# Altium project PCB_Project.PrjPcb
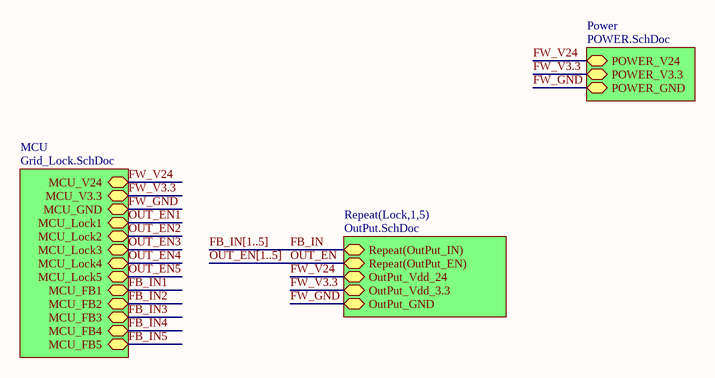
[diagram p0: framework.SchDoc]
4 sheets, 126 parts. Net scope: hierarchical (ports join the sheet entries above them; power ports are global).
Board file: GRID.PcbDoc
Sheets:
  framework.SchDoc
    MCU = Grid_Lock.SchDoc
    Lock1 = OutPut.SchDoc
    Lock2 = OutPut.SchDoc
    Lock3 = OutPut.SchDoc
    Lock4 = OutPut.SchDoc
    Lock5 = OutPut.SchDoc
    Power = POWER.SchDoc

## Sheet framework.SchDoc
size A4

### Sub-sheets
MCU = Grid_Lock.SchDoc: MCU_Lock4, MCU_Lock5, MCU_Lock2, MCU_FB4, MCU_FB2, MCU_FB5, MCU_FB1, MCU_Lock1, MCU_Lock3, MCU_FB3, MCU_V3.3, MCU_GND, MCU_V24
Power = POWER.SchDoc: POWER_GND, POWER_V24, POWER_V3.3
Repeat(Lock,1,5) = OutPut.SchDoc: Repeat(OutPut_IN), Repeat(OutPut_EN), OutPut_Vdd_24, OutPut_GND, OutPut_Vdd_3.3

### Nets
FW_GND: sheet MCU/MCU_GND, sheet Repeat(Lock,1,5)/OutPut_GND, sheet Power/POWER_GND
FW_V3.3: sheet MCU/MCU_V3.3, sheet Repeat(Lock,1,5)/OutPut_Vdd_3.3, sheet Power/POWER_V3.3
FW_V24: sheet MCU/MCU_V24, sheet Repeat(Lock,1,5)/OutPut_Vdd_24, sheet Power/POWER_V24
FB_IN: sheet Repeat(Lock,1,5)/Repeat(OutPut_IN)
OUT_EN: sheet Repeat(Lock,1,5)/Repeat(OutPut_EN)

### Buses and harness runs
bus FB_IN[1..5]
bus OUT_EN[1..5]

## Sheet Grid_Lock.SchDoc
size A4
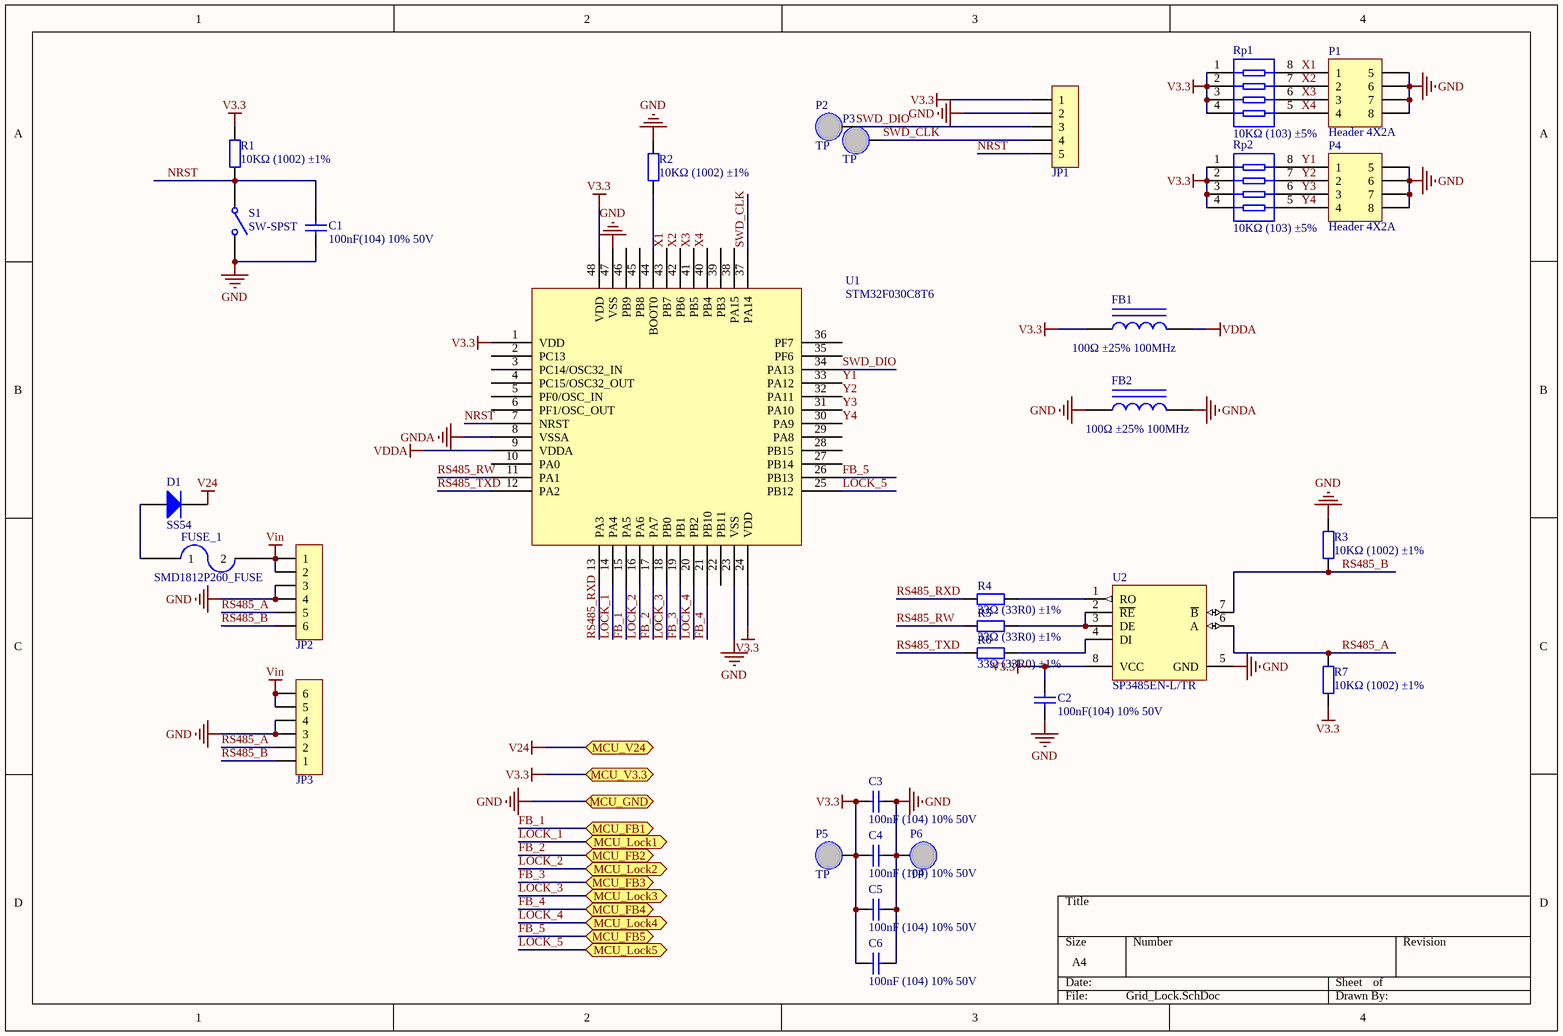
[diagram p1: Grid_Lock.SchDoc]

### Parts
C1  100nF(104) 10% 50V  [0805_C]
C2  100nF(104) 10% 50V  [0805_C]
C3  100nF (104) 10% 50V  [0603_C]
C4  100nF (104) 10% 50V  [0603_C]
C5  100nF (104) 10% 50V  [0603_C]
C6  100nF (104) 10% 50V  [0603_C]
D1  SS54  [SMA(DO-214AC)_S1]
FB1  100Ω ±25% 100MHz  [0805_L]
FB2  100Ω ±25% 100MHz  [0805_L]
FUSE_1  SMD1812P260_FUSE  [SMD1812P260]
JP1  HDR-1X5  [XH2.54-WS-5P]  (value not drawn)
JP2  HDR-1X6  [XH2.54-WS-6P]  (value not drawn)
JP3  HDR-1X6  [XH2.54-WS-6P]  (value not drawn)
P1  Header 4X2A  [HDR2X4_CEN]
P2  TP
P3  TP
P4  Header 4X2A  [HDR2X4_CEN]
P5  TP
P6  TP
R1  10KΩ (1002) ±1%  [0805_R]
R2  10KΩ (1002) ±1%  [0805_R]
R3  10KΩ (1002) ±1%  [0805_R]
R4  33Ω (33R0) ±1%  [0603_R]
R5  33Ω (33R0) ±1%  [0603_R]
R6  33Ω (33R0) ±1%  [0603_R]
R7  10KΩ (1002) ±1%  [0805_R]
Rp1  10KΩ (103) ±5%  [0603_Rx4]
Rp2  10KΩ (103) ±5%  [0603_Rx4]
S1  SW-SPST  [key]
U1  STM32F030C8T6  [LQFP-48_7x7x05P]
U2  SP3485EN-L/TR  [SOIC-8_150mil]

### Ports
MCU_FB1, MCU_FB2, MCU_FB3, MCU_FB4, MCU_FB5, MCU_GND, MCU_Lock1, MCU_Lock2, MCU_Lock3, MCU_Lock4, MCU_Lock5, MCU_V3.3, MCU_V24

### Nets
GND: C1.1 C2.1 C3.2 C4.2 C5.2 C6.2 FB2.1 JP1.2 JP2.3 JP2.4 JP3.3 JP3.4 P1.5 P1.6 P1.7 P1.8 P4.5 P4.6 P4.7 P4.8 P6.1 R2.2 R3.2 S1.2(NO) U1.23(VSS) U1.47(VSS) U2.5(GND) ; port MCU_GND  [project net FW_GND]
GNDA: FB2.2 U1.8(VSSA)
V3.3: C2.2 C3.1 C4.1 C5.1 C6.1 FB1.1 JP1.1 P5.1 R1.2 R7.1 Rp1.1 Rp1.2 Rp1.3 Rp1.4 Rp2.1 Rp2.2 Rp2.3 Rp2.4 U1.1(VDD) U1.24(VDD) U1.48(VDD) U2.8(VCC) ; port MCU_V3.3  [project net FW_V3.3]
V24: D1.2(K) ; port MCU_V24  [project net FW_V24]
VDDA: FB1.2 U1.9(VDDA)
Vin: FUSE_1.2 JP2.1 JP2.2 JP3.5 JP3.6
FB_1: U1.15(PA5) ; port MCU_FB1
FB_2: U1.17(PA7) ; port MCU_FB2
FB_3: U1.19(PB1) ; port MCU_FB3
FB_4: U1.21(PB10) ; port MCU_FB4
FB_5: U1.26(PB13) ; port MCU_FB5
LOCK_1: U1.14(PA4) ; port MCU_Lock1  [project net EN]
LOCK_2: U1.16(PA6) ; port MCU_Lock2  [project net EN]
LOCK_3: U1.18(PB0) ; port MCU_Lock3  [project net EN]
LOCK_4: U1.20(PB2) ; port MCU_Lock4  [project net EN]
LOCK_5: U1.25(PB12) ; port MCU_Lock5  [project net EN]
NRST: C1.2 JP1.5 R1.1 S1.1(COMMON) U1.7(NRST)
RS485_A: JP2.5 JP3.2 R7.2 U2.6(A)
RS485_B: JP2.6 JP3.1 R3.1 U2.7(~{B})
RS485_RW: R5.1 U1.11(PA1)
RS485_RXD: R4.1 U1.13(PA3)
RS485_TXD: R6.1 U1.12(PA2)
SWD_CLK: JP1.4 P3.1 U1.37(PA14)
SWD_DIO: JP1.3 P2.1 U1.34(PA13)
X1: P1.1 Rp1.8 U1.43(PB7)
X2: P1.2 Rp1.7 U1.42(PB6)
X3: P1.3 Rp1.6 U1.41(PB5)
X4: P1.4 Rp1.5 U1.40(PB4)
Y1: P4.1 Rp2.8 U1.33(PA12)
Y2: P4.2 Rp2.7 U1.32(PA11)
Y3: P4.3 Rp2.6 U1.31(PA10)
Y4: P4.4 Rp2.5 U1.30(PA9)
NetD1_1: D1.1(A) FUSE_1.1
NetR2_1: R2.1 U1.44(BOOT0)
NetR4_2: R4.2 U2.1(RO)
NetR5_2: R5.2 U2.2(~{RE}) U2.3(DE)
NetR6_2: R6.2 U2.4(DI)

Not connected (* = marked no-connect by the designer): U1 2(PC13) 3(PC14/OSC32_IN) 4(PC15/OSC32_OUT) 5(PF0/OSC_IN) 6(PF1/OSC_OUT) 10(PA0) 22(PB11) 27(PB14) 28(PB15) 29(PA8) 35(PF6) 36(PF7) 38(PA15) 39(PB3) 45(PB8) 46(PB9)

### Library data of the parts
C1 C2 = 0805 100nF(104) 10% 50V: 贴片电容; ComponentLink1Description: 供应商链接; ComponentLink1URL: http://www.szlcsc.com/product/details_50686.html; Package: 0805; Supplier: LC; SuppliersPartNumber: C49678
C3-C6 = 0603 100nF (104) 10% 50V: 贴片电容; ComponentLink1Description: 供应商链接; ComponentLink1URL: http://www.szlcsc.com/product/details_15331.html; Package: 0603; Supplier: LC; SuppliersPartNumber: C14663
D1 = SMA(DO-214AC) SS54: 二极管; ComponentLink1Description: 供应商链接; ComponentLink1URL: http://www.szlcsc.com/product/details_23178.html; Package: SMA(DO-214AC); Supplier: LC; SuppliersPartNumber: C22452
FB1 FB2 = 0805 100Ω 25% 100MHz: 贴片磁珠; ComponentLink1Description: 供应商链接; ComponentLink1URL: http://www.szlcsc.com/product/details_1367.html; Package: 0805; Supplier: LC; SuppliersPartNumber: C1015
JP1 = Header 5: 5P接插件; 版权归属: 源创客; BOM名称: 5P接插件; 学习资源: www.ooocke.com
JP2 JP3 = Header 6: 6P接插件; 版权归属: 源创客; BOM名称: 6P接插件; 学习资源: www.ooocke.com
P1 P4 = Header 4X2A: Header, 4-Pin, Dual row; LatestRevisionDate: 17-Jul-2002; LatestRevisionNote: Re-released for DXP Platform.; Publisher: Altium Limited
R1-R3 R7 = 0805 10KΩ (1002) 1%: 贴片电阻; ComponentLink1Description: 供应商链接; ComponentLink1URL: http://www.szlcsc.com/product/details_18102.html; Package: 0805; Supplier: LC; SuppliersPartNumber: C17414
R4-R6 = 0603 33Ω (33R0) 1%: 贴片电阻; ComponentLink1Description: 供应商链接; ComponentLink1URL: http://www.szlcsc.com/product/details_23867.html; Package: 0603; Supplier: LC; SuppliersPartNumber: C23140
Rp1 Rp2 = 0603*4  10KΩ (103) 5%: 贴片排阻; ComponentLink1Description: 供应商链接; ComponentLink1URL: http://www.szlcsc.com/product/details_30472.html; Package: 0603*4; Supplier: LC; SuppliersPartNumber: C29718
S1 = SW-SPST: Single-Pole, Single-Throw Switch; Published: 24-Mar-1999; LatestRevisionDate: 17-Jul-2002; LatestRevisionNote: Re-released for DXP Platform.; PackageReference: SPST-2; Publisher: Altium Limited; PackageDescription: Switch; 2 Leads
U1 = STM32F030C8T6: ARM; ComponentLink1Description: 供应商链接; ComponentLink1URL: http://www.szlcsc.com/product/details_24662.html; Package: LQFP-48_7x7x05P; Supplier: LC; SuppliersPartNumber: C23922
U2 = SP3485EN-L/TR_[C8963]: RS-485/RS-422; ComponentLink1Description: 供应商链接; ComponentLink1URL: http://www.szlcsc.com/product/details_9482.html; Package: SOIC-8; Supplier: LC; SuppliersPartNumber: C8963

## Sheet OutPut.SchDoc
size A4
Used 5 times, as channels Lock1, Lock2, Lock3, Lock4, Lock5. Parts and nets are listed once, with the designators drawn on the sheet.
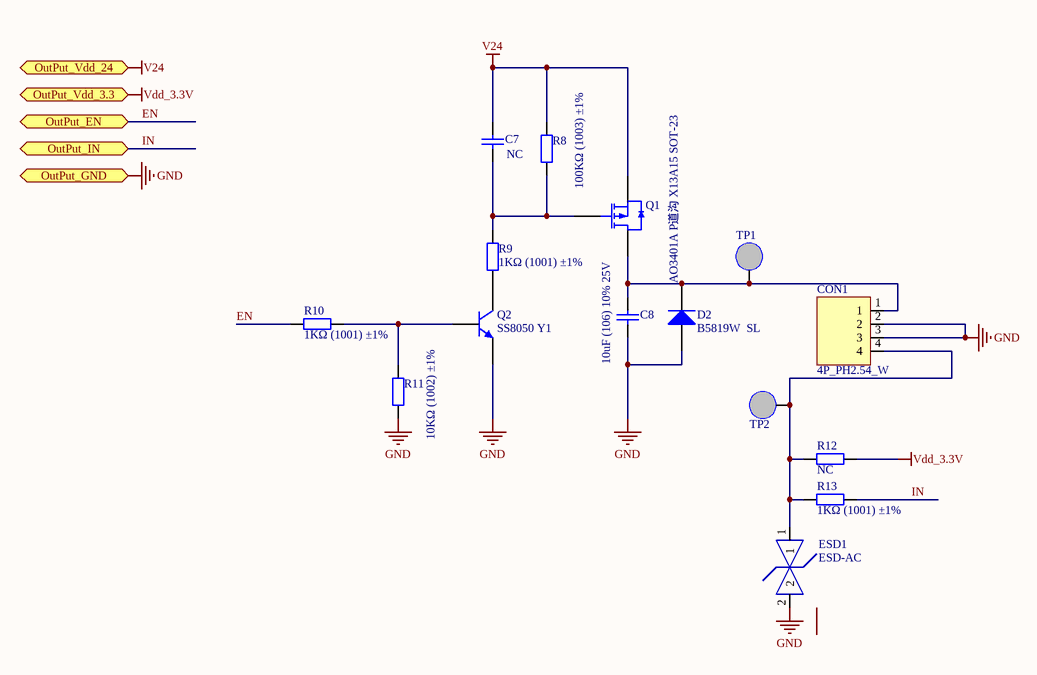
[diagram p2: OutPut.SchDoc]

### Parts
C7  NC  [0805_C]
C8  10uF (106) 10% 25V  [0805_C]
CON1  4P_PH2.54_W  [PH2.0-WS-4P]
D2  B5819W  SL  [SOD-123]
ESD1  ESD-AC  [SOD-523]
Q1  AO3401A P道沟 X13A15 SOT-23  [SOT-23-3L]
Q2  SS8050 Y1  [SOT-23(SOT-23-3)]
R8  100KΩ (1003) ±1%  [0805_R]
R9  1KΩ (1001) ±1%  [0805_R]
R10  1KΩ (1001) ±1%  [0805_R]
R11  10KΩ (1002) ±1%  [0805_R]
R12  NC  [0805_R]
R13  1KΩ (1001) ±1%  [0805_R]
TP1  TP  [TP]  (value not drawn)
TP2  TP  [TP]  (value not drawn)

### Ports
OutPut_EN, OutPut_GND, OutPut_IN, OutPut_Vdd_3.3, OutPut_Vdd_24

### Nets
GND: C8.1 CON1.2 CON1.3 D2.1(A) ESD1.2 Q2.2(E) R11.1 ; port OutPut_GND
V24: C7.2 Q1.2(S) R8.2 ; port OutPut_Vdd_24
Vdd_3.3V: R12.2 ; port OutPut_Vdd_3.3
EN: R10.1 ; port OutPut_EN
IN: R13.2 ; port OutPut_IN
NetC7_1: C7.1 Q1.1(G) R8.1 R9.1
NetC8_2: C8.2 CON1.1 D2.2(K) Q1.3(D) TP1.1
NetCON1_4: CON1.4 ESD1.1 R12.1 R13.1 TP2.1
NetQ2_1: Q2.1(B) R10.2 R11.2
NetQ2_3: Q2.3(C) R9.2

Not connected (* = marked no-connect by the designer): CON1 A B

### Channels
Lock1: designators end in _Lock1; ports OutPut_EN=EN OutPut_GND=FW_GND OutPut_IN=FB_1 OutPut_Vdd_3.3=FW_V3.3 OutPut_Vdd_24=FW_V24
Lock2: designators end in _Lock2; ports OutPut_EN=EN OutPut_GND=FW_GND OutPut_IN=FB_2 OutPut_Vdd_3.3=FW_V3.3 OutPut_Vdd_24=FW_V24
Lock3: designators end in _Lock3; ports OutPut_EN=EN OutPut_GND=FW_GND OutPut_IN=FB_3 OutPut_Vdd_3.3=FW_V3.3 OutPut_Vdd_24=FW_V24
Lock4: designators end in _Lock4; ports OutPut_EN=EN OutPut_GND=FW_GND OutPut_IN=FB_4 OutPut_Vdd_3.3=FW_V3.3 OutPut_Vdd_24=FW_V24
Lock5: designators end in _Lock5; ports OutPut_EN=EN OutPut_GND=FW_GND OutPut_IN=FB_5 OutPut_Vdd_3.3=FW_V3.3 OutPut_Vdd_24=FW_V24

### Library data of the parts
C7 = 0805 22uF (226) 20% 25V: 贴片电容; ComponentLink1Description: 供应商链接; ComponentLink1URL: http://www.szlcsc.com/product/details_46786.html; Package: 0805; Supplier: LC; SuppliersPartNumber: C45783
C8 = 0805 10uF (106) 10% 25V: 贴片电容; ComponentLink1Description: 供应商链接; ComponentLink1URL: http://www.szlcsc.com/product/details_16532.html; Package: 0805; Supplier: LC; SuppliersPartNumber: C15850
CON1 = 4P_XH2.54_W
D2 = SOD-123 B5819W  SL: 肖特基二极管; ComponentLink1Description: 供应商链接; ComponentLink1URL: http://www.szlcsc.com/product/details_9093.html; Package: SOD-123; Supplier: LC; SuppliersPartNumber: C8598
Q1 = AO3401A P道沟 X13A15 SOT-23: MOS(场效应管); ComponentLink1Description: 供应商链接; ComponentLink1URL: http://www.szlcsc.com/product/details_15801.html; Package: SOT-23; Supplier: LC; SuppliersPartNumber: C15127
Q2 = SOT-23 SS8050 Y1: 三极管; ComponentLink1Description: 供应商链接; ComponentLink1URL: http://www.szlcsc.com/product/details_2507.html; Package: SOT-23; Supplier: LC; SuppliersPartNumber: C2150
R8 = 0805 100KΩ (1003) 1%: 贴片电阻; ComponentLink1Description: 供应商链接; ComponentLink1URL: http://www.szlcsc.com/product/details_18095.html; Package: 0805; Supplier: LC; SuppliersPartNumber: C17407
R9 R10 R12 R13 = 0805 1KΩ (1001) 1%: 贴片电阻; ComponentLink1Description: 供应商链接; ComponentLink1URL: http://www.szlcsc.com/product/details_18201.html; Package: 0805; Supplier: LC; SuppliersPartNumber: C17513
R11 = 0805 10KΩ (1002) 1%: 贴片电阻; ComponentLink1Description: 供应商链接; ComponentLink1URL: http://www.szlcsc.com/product/details_18102.html; Package: 0805; Supplier: LC; SuppliersPartNumber: C17414

## Sheet POWER.SchDoc
size A4
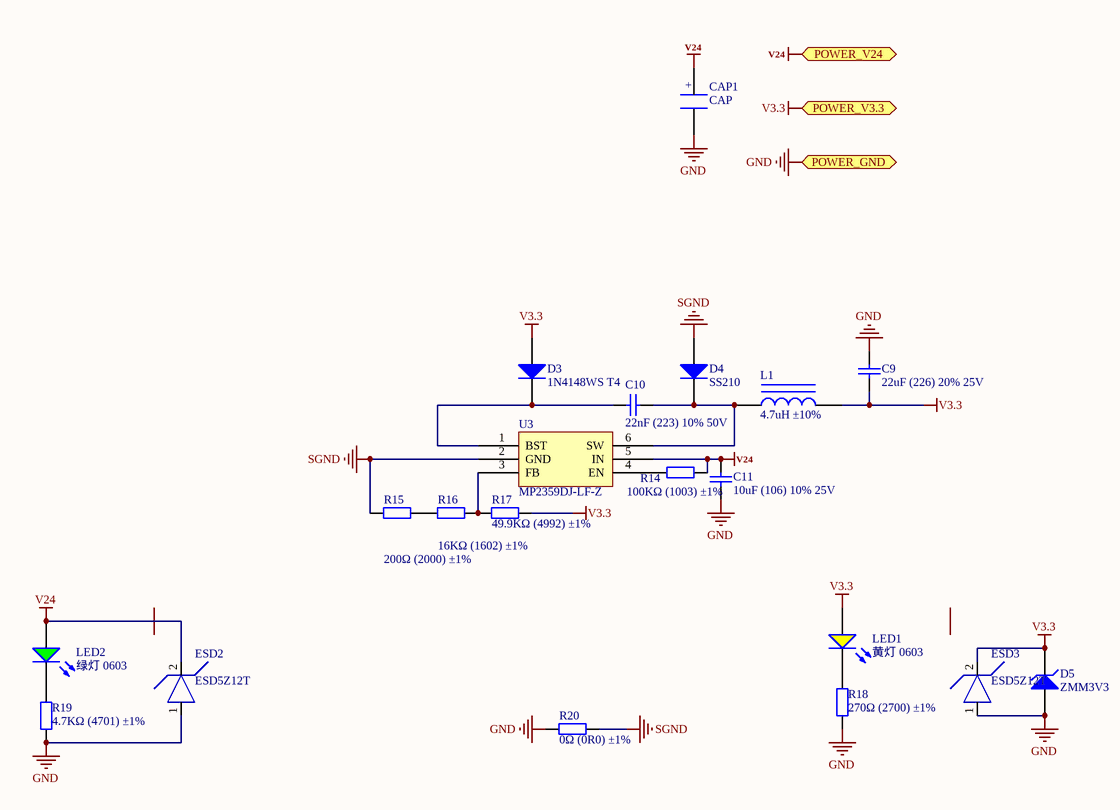
[diagram p3: POWER.SchDoc]

### Parts
C9  22uF (226) 20% 25V  [0805_C]
C10  22nF (223) 10% 50V  [0603_C]
C11  10uF (106) 10% 25V  [0805_C]
CAP1  CAP  [8X12_CAP]
D3  1N4148WS T4  [SOD-323]
D4  SS210  [SMA(DO-214AC)_S1]
D5  ZMM3V3  [LL-34]
ESD2  ESD5Z12T  [SOD-523]
ESD3  ESD5Z12T  [SOD-523]
L1  4.7uH ±10%  [L_4030]
LED1  黄灯 0603  [0603_LED_S1]
LED2  绿灯 0603  [0603_LED_S1]
R14  100KΩ (1003) ±1%  [0603_R]
R15  200Ω (2000) ±1%  [0603_R]
R16  16KΩ (1602) ±1%  [0603_R]
R17  49.9KΩ (4992) ±1%  [0603_R]
R18  270Ω (2700) ±1%  [0805_R]
R19  4.7KΩ (4701) ±1%  [0805_R]
R20  0Ω (0R0) ±1%  [0603_R]
U3  MP2359DJ-LF-Z  [SOT-23-6]

### Ports
POWER_GND, POWER_V3.3, POWER_V24

### Nets
GND: C9.2 C11.1 CAP1.2 D5.1(A) ESD2.1 ESD3.1 R18.1 R19.1 R20.1 ; port POWER_GND  [project net FW_GND]
SGND: D4.1(A) R15.2 R20.2 U3.2(GND)
V3.3: C9.1 D3.1(A) D5.2(K) ESD3.2 L1.2 LED1.A R17.2 ; port POWER_V3.3  [project net FW_V3.3]
V24: C11.2 CAP1.1 ESD2.2 LED2.A R14.2 U3.5(IN) ; port POWER_V24  [project net FW_V24]
NetC10_1: C10.1 D3.2(K) U3.1(BST)
NetC10_2: C10.2 D4.2(K) L1.1 U3.6(SW)
NetLED1_K: LED1.K R18.2
NetLED2_K: LED2.K R19.2
NetR14_1: R14.1 U3.4(EN)
NetR15_1: R15.1 R16.2
NetR16_1: R16.1 R17.1 U3.3(FB)

### Notes on the sheet
- (in symbol CAP) +

### Library data of the parts
C9 = 0805 22uF (226) 20% 25V: 贴片电容; ComponentLink1Description: 供应商链接; ComponentLink1URL: http://www.szlcsc.com/product/details_46786.html; Package: 0805; Supplier: LC; SuppliersPartNumber: C45783
C10 = 0603 22nF (223) 10% 50V: 贴片电容; ComponentLink1Description: 供应商链接; ComponentLink1URL: http://www.szlcsc.com/product/details_21834.html; Package: 0603; Supplier: LC; SuppliersPartNumber: C21122
C11 = 0805 10uF (106) 10% 25V: 贴片电容; ComponentLink1Description: 供应商链接; ComponentLink1URL: http://www.szlcsc.com/product/details_16532.html; Package: 0805; Supplier: LC; SuppliersPartNumber: C15850
D3 = SOD-323 1N4148WS T4: 二极管; ComponentLink1Description: 供应商链接; ComponentLink1URL: http://www.szlcsc.com/product/details_2485.html; Package: SOD-323; Supplier: LC; SuppliersPartNumber: C2128
D4 = SMA(DO-214AC) SS210: 二极管; ComponentLink1Description: 供应商链接; ComponentLink1URL: http://www.szlcsc.com/product/details_15669.html; Package: SMA(DO-214AC); Supplier: LC; SuppliersPartNumber: C14996
D5 = LL-34 ZMM3V3: 稳压二极管; ComponentLink1Description: 供应商链接; ComponentLink1URL: http://www.szlcsc.com/product/details_8535.html; Package: LL-34; Supplier: LC; SuppliersPartNumber: C8056
ESD2 ESD3 = ESD-D
L1 = 0603 4.7uH 10%: 贴片电感; ComponentLink1Description: 供应商链接; ComponentLink1URL: http://www.szlcsc.com/product/details_1386.html; Package: 0603; Supplier: LC; SuppliersPartNumber: C1034
LED1 = 0603 黄灯: 发光二极管; ComponentLink1Description: 供应商链接; ComponentLink1URL: http://www.szlcsc.com/product/details_73147.html; Package: 0603; Supplier: LC; SuppliersPartNumber: C72038
LED2 = 0603 绿灯: 发光二极管; ComponentLink1Description: 供应商链接; ComponentLink1URL: http://www.szlcsc.com/product/details_73152.html; Package: 0603; Supplier: LC; SuppliersPartNumber: C72043
R14 = 0603 100KΩ (1003) 1%: 贴片电阻; ComponentLink1Description: 供应商链接; ComponentLink1URL: http://www.szlcsc.com/product/details_26546.html; Package: 0603; Supplier: LC; SuppliersPartNumber: C25803
R15 = 0603 200Ω (2000) 1%: 贴片电阻; ComponentLink1Description: 供应商链接; ComponentLink1URL: http://www.szlcsc.com/product/details_8708.html; Package: 0603; Supplier: LC; SuppliersPartNumber: C8218
R16 = 0603 16KΩ (1602) 1%: 贴片电阻; ComponentLink1Description: 供应商链接; ComponentLink1URL: http://www.szlcsc.com/product/details_23545.html; Package: 0603; Supplier: LC; SuppliersPartNumber: C22818
R17 = 0603 49.9KΩ (4992) 1%: 贴片电阻; ComponentLink1Description: 供应商链接; ComponentLink1URL: http://www.szlcsc.com/product/details_23911.html; Package: 0603; Supplier: LC; SuppliersPartNumber: C23184
R18 = 0805 270Ω (2700) 1%: 贴片电阻; ComponentLink1Description: 供应商链接; ComponentLink1URL: http://www.szlcsc.com/product/details_18278.html; Package: 0805; Supplier: LC; SuppliersPartNumber: C17590
R19 = 0805 4.7KΩ (4701) 1%: 贴片电阻; ComponentLink1Description: 供应商链接; ComponentLink1URL: http://www.szlcsc.com/product/details_18361.html; Package: 0805; Supplier: LC; SuppliersPartNumber: C17673
R20 = 0603 0Ω (0R0) 1%: 贴片电阻; ComponentLink1Description: 供应商链接; ComponentLink1URL: http://www.szlcsc.com/product/details_21903.html; Package: 0603; Supplier: LC; SuppliersPartNumber: C21189
U3 = MP2359DJ-LF-Z_[C14259]: DC-DC芯片; ComponentLink1Description: 供应商链接; ComponentLink1URL: http://www.szlcsc.com/product/details_14917.html; Package: SOT-23-6; Supplier: LC; SuppliersPartNumber: C14259

## Nets that join several sheets
FW_GND: Grid_Lock (27 pins), Lock1 (7 pins), Lock2 (7 pins), Lock3 (7 pins), Lock4 (7 pins), Lock5 (7 pins), POWER (9 pins)
FW_V3.3: Grid_Lock (22 pins), Lock1 (R12_Lock1.2), Lock2 (R12_Lock2.2), Lock3 (R12_Lock3.2), Lock4 (R12_Lock4.2), Lock5 (R12_Lock5.2), POWER (7 pins)
FW_V24: Grid_Lock (D1.2), Lock1 (C7_Lock1.2 Q1_Lock1.2 R8_Lock1.2), Lock2 (C7_Lock2.2 Q1_Lock2.2 R8_Lock2.2), Lock3 (C7_Lock3.2 Q1_Lock3.2 R8_Lock3.2), Lock4 (C7_Lock4.2 Q1_Lock4.2 R8_Lock4.2), Lock5 (C7_Lock5.2 Q1_Lock5.2 R8_Lock5.2), POWER (6 pins)
EN: Grid_Lock (U1.14), Lock1 (R10_Lock1.1)
EN: Grid_Lock (U1.16), Lock2 (R10_Lock2.1)
EN: Grid_Lock (U1.18), Lock3 (R10_Lock3.1)
EN: Grid_Lock (U1.20), Lock4 (R10_Lock4.1)
EN: Grid_Lock (U1.25), Lock5 (R10_Lock5.1)
FB_1: Grid_Lock (U1.15), Lock1 (R13_Lock1.2)
FB_2: Grid_Lock (U1.17), Lock2 (R13_Lock2.2)
FB_3: Grid_Lock (U1.19), Lock3 (R13_Lock3.2)
FB_4: Grid_Lock (U1.21), Lock4 (R13_Lock4.2)
FB_5: Grid_Lock (U1.26), Lock5 (R13_Lock5.2)